# Altium schematic sheet 多种信号发生器.schdoc
size 313 x 221 mm
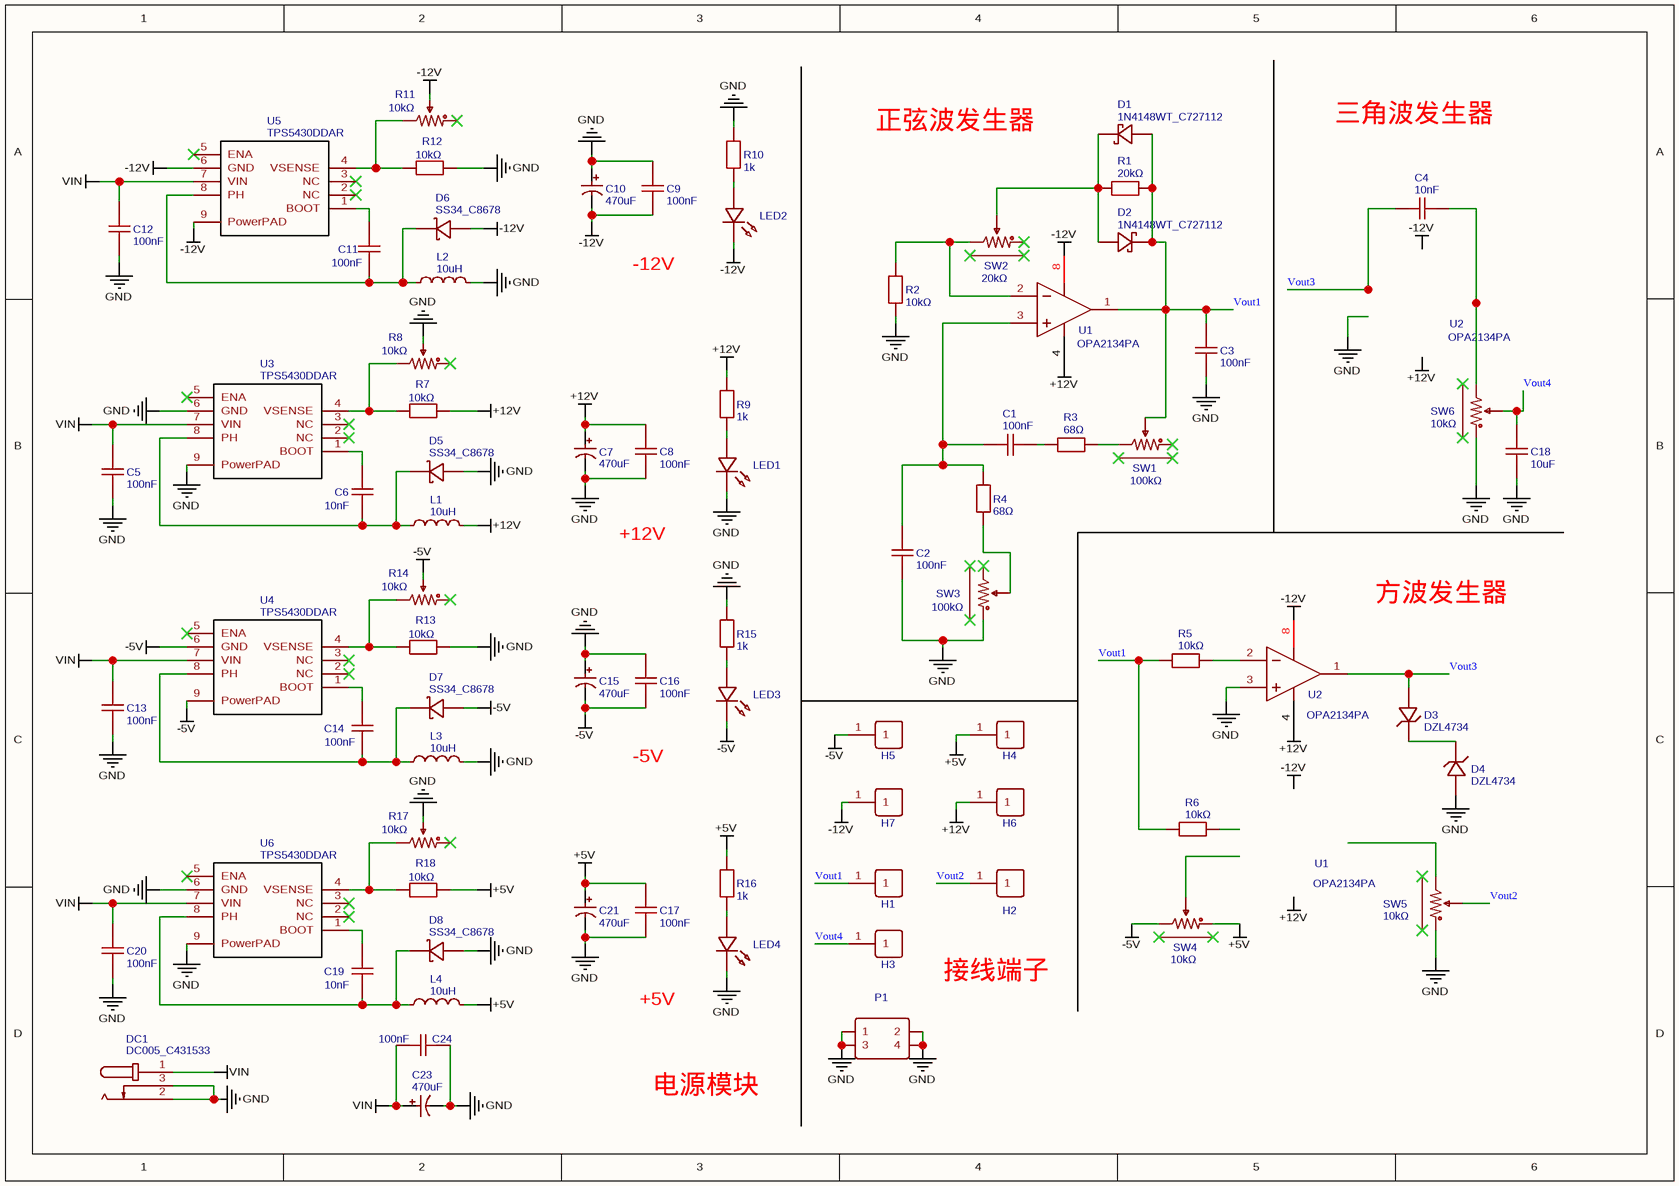
[diagram p0: 多种信号发生器.schdoc]

## Parts
(Parts that share a designator on the sheet are numbered #1, #2 ... from top to bottom, then left to right.)
C1  100nF  [C0603]
C2  100nF  [C0603]
C3  100nF  [C0603]
C4  10nF  [C0603]
C5  100nF  [C0603]
C6  10nF  [C0603]
C7  470uF  [CAP-TH_BD10.0-P5.00-D1.0-FD]
C8  100nF  [C0603]
C9  100nF  [C0603]
C10  470uF  [CAP-TH_BD10.0-P5.00-D1.0-FD]
C11  100nF  [C0603]
C12  100nF  [C0603]
C13  100nF  [C0603]
C14  100nF  [C0603]
C15  470uF  [CAP-TH_BD10.0-P5.00-D1.0-FD]
C16  100nF  [C0603]
C17  100nF  [C0603]
C18  10uF  [C0603]
C19  10nF  [C0603]
C20  100nF  [C0603]
C21  470uF  [CAP-TH_BD10.0-P5.00-D1.0-FD]
C23  470uF  [CAP-TH_BD10.0-P5.00-D1.0-FD]
C24  100nF  [C0603]
D1  1N4148WT_C727112  [SOD-523_L1.2-W0.8-LS1.6-RD]
D2  1N4148WT_C727112  [SOD-523_L1.2-W0.8-LS1.6-RD]
D3  DZL4734  [SOD-123_L2.8-W1.8-LS3.7-RD]
D4  DZL4734  [SOD-123_L2.8-W1.8-LS3.7-RD]
D5  SS34_C8678  [SMA_L4.3-W2.6-LS5.2-RD]
D6  SS34_C8678  [SMA_L4.3-W2.6-LS5.2-RD]
D7  SS34_C8678  [SMA_L4.3-W2.6-LS5.2-RD]
D8  SS34_C8678  [SMA_L4.3-W2.6-LS5.2-RD]
DC1  DC005_C431533  [DC-IN-TH_DC005]
H1  PZ254V-11-01P  [HDR-TH_1P-P2.54-V-M]  (value not drawn)
H2  PZ254V-11-01P  [HDR-TH_1P-P2.54-V-M]  (value not drawn)
H3  PZ254V-11-01P  [HDR-TH_1P-P2.54-V-M]  (value not drawn)
H4  PZ254V-11-01P  [HDR-TH_1P-P2.54-V-M]  (value not drawn)
H5  PZ254V-11-01P  [HDR-TH_1P-P2.54-V-M]  (value not drawn)
H6  PZ254V-11-01P  [HDR-TH_1P-P2.54-V-M]  (value not drawn)
H7  PZ254V-11-01P  [HDR-TH_1P-P2.54-V-M]  (value not drawn)
L1  10uH  [IND-SMD_L7.3-W6.8]
L2  10uH  [IND-SMD_L7.3-W6.8]
L3  10uH  [IND-SMD_L7.3-W6.8]
L4  10uH  [IND-SMD_L7.3-W6.8]
LED1  LED-0603_R  [LED0603_RED]  (value not drawn)
LED2  LED-0603_R  [LED0603_RED]  (value not drawn)
LED3  LED-0603_R  [LED0603_RED]  (value not drawn)
LED4  LED-0603_R  [LED0603_RED]  (value not drawn)
P1  Header-Male-2.54_2x2  [HDR-TH_4P-P2.54-V-M-R2-C2-S2.54-1]  (value not drawn)
R1  20kΩ  [R0603]
R2  10kΩ  [R0603]
R3  68Ω  [R0603]
R4  68Ω  [R0603]
R5  10kΩ  [R0603]
R6  10kΩ  [R0603]
R7  10kΩ  [R0603]
R8  10kΩ  [RES-ADJ-TH_3P-L10.0-W10.0-P2.50-L]
R9  1k  [R0603]
R10  1k  [R0603]
R11  10kΩ  [RES-ADJ-TH_3P-L10.0-W10.0-P2.50-L]
R12  10kΩ  [R0603]
R13  10kΩ  [R0603]
R14  10kΩ  [RES-ADJ-TH_3P-L10.0-W10.0-P2.50-L]
R15  1k  [R0603]
R16  1k  [R0603]
R17  10kΩ  [RES-ADJ-TH_3P-L10.0-W10.0-P2.50-L]
R18  10kΩ  [R0603]
SW1  100kΩ  [RES-ADJ-TH_RK09D1130C4G]
SW2  20kΩ  [RES-ADJ-TH_RK09D1130C4G]
SW3  100kΩ  [RES-ADJ-TH_RK09D1130C4G]
SW4  10kΩ  [RES-ADJ-TH_RK09D1130C4G]
SW5  10kΩ  [RES-ADJ-TH_RK09D1130C4G]
SW6  10kΩ  [RES-ADJ-TH_RK09D1130C4G]
U1#1  OPA2134PA  [DIP-8_L9.6-W6.4-P2.54-LS7.6-BL-1]
U1#2  OPA2134PA  [DIP-8_L9.6-W6.4-P2.54-LS7.6-BL-1]
U2#1  OPA2134PA  [DIP-8_L9.6-W6.4-P2.54-LS7.6-BL-1]
U2#2  OPA2134PA  [DIP-8_L9.6-W6.4-P2.54-LS7.6-BL-1]
U3  TPS5430DDAR  [ESOP-8_L4.9-W3.9-P1.27-LS6.0-TL-EP]
U4  TPS5430DDAR  [ESOP-8_L4.9-W3.9-P1.27-LS6.0-TL-EP]
U5  TPS5430DDAR  [ESOP-8_L4.9-W3.9-P1.27-LS6.0-TL-EP]
U6  TPS5430DDAR  [ESOP-8_L4.9-W3.9-P1.27-LS6.0-TL-EP]

## Nets
+5V: C17.1 C21.1 H4.1 L4.2 R16.2 R18.1 SW4.1
+12V: C7.1 C8.1 H6.1 L1.2 R7.1 R9.2 U1#1.4(V-) U2#2.4(V-)
-5V: C15.2 C16.2 D7.2(A) H5.1 LED3.2 R14.2 SW4.3 U4.6(GND) U4.9(PowerPAD)
-12V: C9.2 C10.2 D6.2(A) H7.1 LED2.2 R11.2 U1#1.8(V+) U2#2.8(V+) U5.6(GND) U5.9(PowerPAD)
GND: C2.2 C3.2 C5.2 C7.2 C8.2 C9.1 C10.1 C12.2 C13.2 C15.1 C16.1 C17.2 C18.1 C20.2 C21.2 C23.2 C24.2 D4.2 D5.2(A) D8.2(A) DC1.2 DC1.3 L2.2 L3.2 LED1.2 LED4.2 P1.1 P1.2 P1.3 P1.4 R2.1 R8.2 R10.2 R12.1 R13.1 R15.2 R17.2 SW3.1 SW5.1 SW6.1 U2#2.3(+IN_A) U3.6(GND) U3.9(PowerPAD) U6.6(GND) U6.9(PowerPAD)
VIN: C5.1 C12.1 C13.1 C20.1 C23.1 C24.1 DC1.1 U3.7(VIN) U4.7(VIN) U5.7(VIN) U6.7(VIN)
Vout1: C3.1 D1.2(A) D2.1(C) H1.1 R1.2 R5.2 R6.2 SW1.2 U1#1.1(OUT_A)
Vout2: H2.1 SW5.2
Vout3: C4.2 D3.2 U2#2.1(OUT_A)
Vout4: C18.2 H3.1 SW6.2
NetC1_1: C1.1 R3.1
NetC1_2: C1.2 C2.1 R4.2 U1#1.3(+IN_A)
NetC4_1: C4.1 SW6.3
NetC6_1: C6.1 U3.1(BOOT)
NetC6_2: C6.2 D5.1(K) L1.1 U3.8(PH)
NetC11_1: C11.1 U5.1(BOOT)
NetC11_2: C11.2 D6.1(K) L2.1 U5.8(PH)
NetC14_1: C14.1 U4.1(BOOT)
NetC14_2: C14.2 D7.1(K) L3.1 U4.8(PH)
NetC19_1: C19.1 U6.1(BOOT)
NetC19_2: C19.2 D8.1(K) L4.1 U6.8(PH)
NetD1_1: D1.1(C) D2.2(A) R1.1 SW2.2
NetD3_1: D3.1 D4.1
NetLED1_1: LED1.1 R9.1
NetLED2_1: LED2.1 R10.1
NetLED3_1: LED3.1 R15.1
NetLED4_1: LED4.1 R16.1
NetR2_2: R2.2 SW2.3 U1#1.2(-IN_A)
NetR3_2: R3.2 SW1.3
NetR4_1: R4.1 SW3.2
NetR5_1: R5.1 U2#2.2(-IN_A)
NetR7_2: R7.2 R8.3 U3.4(VSENSE)
NetR11_3: R11.3 R12.2 U5.4(VSENSE)
NetR13_2: R13.2 R14.3 U4.4(VSENSE)
NetR17_3: R17.3 R18.2 U6.4(VSENSE)

Not connected (* = marked no-connect by the designer): R6 1; R8 1*; R11 1*; R14 1*; R17 1*; SW1 1* 4* 5*; SW2 1* 4* 5*; SW3 3* 4* 5*; SW4 2 4* 5*; SW5 3 4* 5*; SW6 4* 5*; U3 2(NC)* 3(NC)* 5(ENA)*; U4 2(NC)* 3(NC)* 5(ENA)*; U5 2(NC)* 3(NC)* 5(ENA)*; U6 2(NC)* 3(NC)* 5(ENA)*

## Notes on the sheet
- 三角波发生器
- 正弦波发生器
- -12V
- +12V
- 方波发生器
- -5V
- +5V
- 接线端子
- 电源模块
- Labels drawn without touching a wire or pin: +12V, -12V

## Library data of the parts
C1-C3 C5 C8 C9 C11-C14 C16 C17 C20 C24 = 100nF: nameAlias: Value(F); Contributor: LCEDA_Lib; spicePre: C; spiceSymbolName: C_0603_US
C4 C6 C19 = 10nF: nameAlias: Value(F); Contributor: LCEDA_Lib; spicePre: C; spiceSymbolName: C_0603_US
C7 C10 C15 C21 C23 = 470uF: Manufacturer: AISHI(艾华集团); Manufacturer Part: ERS1HM471G20OT; nameAlias: Value; Supplier: LCSC; Supplier Part: C106666; JLCPCB Part Class: Extended Part; spicePre: C; spiceSymbolName: ERS1HM471G20OT
C18 = 10uF: nameAlias: Value(F); Contributor: LCEDA_Lib; spicePre: C; spiceSymbolName: C_0603_US
D1 D2 = 1N4148WT_C727112: Manufacturer: TWGMC(台湾迪嘉); Contributor: LCSC; Supplier: LCSC; Supplier Part: C727112; Manufacturer Part: 1N4148WT; JLCPCB Part Class: Extended Part; spicePre: D; spiceSymbolName: 1N4148WT_C727112
D3 D4 = DZL4734: Manufacturer: LGE(鲁光); Contributor: LCSC; Supplier: LCSC; Supplier Part: C362311; Manufacturer Part: DZL4734; JLCPCB Part Class: Extended Part; spicePre: D; spiceSymbolName: DZL4734
D5-D8 = SS34_C8678: Manufacturer Part: SS34; Manufacturer: MDD; Supplier: LCSC; Supplier Part: C8678; JLCPCB Part Class: Basic Part; spicePre: D; spiceSymbolName: SS34_C8678
DC1 = DC005_C431533: Manufacturer: SHOU HAN(首韩); Manufacturer Part: DC005; Contributor: LCSC; Supplier: LCSC; Supplier Part: C431533; JLCPCB Part Class: Extended Part; spicePre: D; spiceSymbolName: DC005_C431533
H1-H7 = PZ254V-11-01P: Manufacturer: XFCN(兴飞); Contributor: LCSC; Supplier: LCSC; Supplier Part: C492400; Manufacturer Part: PZ254V-11-01P; JLCPCB Part Class: Extended Part; spicePre: H; spiceSymbolName: PZ254V-11-01P
L1-L4 = 10uH: Manufacturer: cjiang(长江微电); Manufacturer Part: FXL0630-100-M; nameAlias: Value; Contributor: LCSC; Package Display: No; Supplier: LCSC; Supplier Part: C167223; JLCPCB Part Class: Extended Part; spicePre: L; spiceSymbolName: FXL0630-100-M
LED1-LED4 = LED-0603_R: Manufacturer: EVERLIGHT(台湾亿光); Manufacturer Part: 19-217/R6C-AL1M2VY/3T; Contributor: LCEDA_01; Supplier Part: C72044; Supplier: LCSC; spicePre: L; spiceSymbolName: LED-0603_R
P1 = Header-Male-2.54_2x2: Manufacturer: BOOMELE(博穆精密); Manufacturer Part: 2.54-2*2P针; Supplier: LCSC; Supplier Part: C66690; JLCPCB Part Class: Extended Part; spicePre: P; spiceSymbolName: Header-Male-2.54_2x2
R1 = 20kΩ: nameAlias: Value(Ω); Contributor: LCEDA_Lib; spicePre: R; spiceSymbolName: R_0603_EU
R2 R5-R7 R12 R13 R18 = 10kΩ: nameAlias: Value(Ω); Contributor: LCEDA_Lib; spicePre: R; spiceSymbolName: R_0603_EU
R3 R4 = 68Ω: nameAlias: Value(Ω); Contributor: LCEDA_Lib; spicePre: R; spiceSymbolName: R_0603_EU
R8 R11 R14 R17 = 10kΩ: Manufacturer: BOCHEN(博晨); Manufacturer Part: 3296W-1-103; Resistance(Ohms): 10K; nameAlias: Value; Contributor: LCSC; Supplier: LCSC; Supplier Part: C118954; JLCPCB Part Class: Extended Part; spicePre: R; spiceSymbolName: 3296W-1-103
R9 R10 R15 R16 = 1k: nameAlias: Value(Ω); Contributor: LCEDA_Lib; spicePre: R; spiceSymbolName: R_0603_EU
SW1 SW3 = 100kΩ: Manufacturer: ALPSALPINE(阿尔卑斯阿尔派); Manufacturer Part: RK09K1130AV7; nameAlias: Value; Contributor: LCSC; Supplier: LCSC; Supplier Part: C470296; JLCPCB Part Class: Extended Part; spicePre: S; spiceSymbolName: RK09K1130AV7
SW2 = 20kΩ: Manufacturer: ALPSALPINE(阿尔卑斯阿尔派); Manufacturer Part: RK09K1130AV7; nameAlias: Value; Contributor: LCSC; Supplier: LCSC; Supplier Part: C470296; JLCPCB Part Class: Extended Part; spicePre: S; spiceSymbolName: RK09K1130AV7
SW4-SW6 = 10kΩ: Manufacturer: ALPSALPINE(阿尔卑斯阿尔派); Manufacturer Part: RK09K1130AV7; nameAlias: Value; Contributor: LCSC; Supplier: LCSC; Supplier Part: C470296; JLCPCB Part Class: Extended Part; spicePre: S; spiceSymbolName: RK09K1130AV7
U1#1 U1#2 U2#1 U2#2 = OPA2134PA: subpart_no: 1; Manufacturer: TI(德州仪器); Contributor: LCSC; Supplier: LCSC; Supplier Part: C1346118; Manufacturer Part: OPA2134PA; JLCPCB Part Class: Extended Part; link: https://so.szlcsc.com/global.html?k=C1346118&ref=editor; spicePre: U; spiceSymbolName: OPA2134PA
U3-U6 = TPS5430DDAR: Manufacturer: TI(德州仪器); Supplier: LCSC; Manufacturer Part: TPS5430DDAR; Supplier Part: C9864; JLCPCB Part Class: Basic Part; spicePre: U; spiceSymbolName: TPS5430DDAR